# EAGLE schematic bornhack_stoplicht_ws2812_smd_405_cap_r155 (EAGLE 6.1)

## Sheet 1 of 4
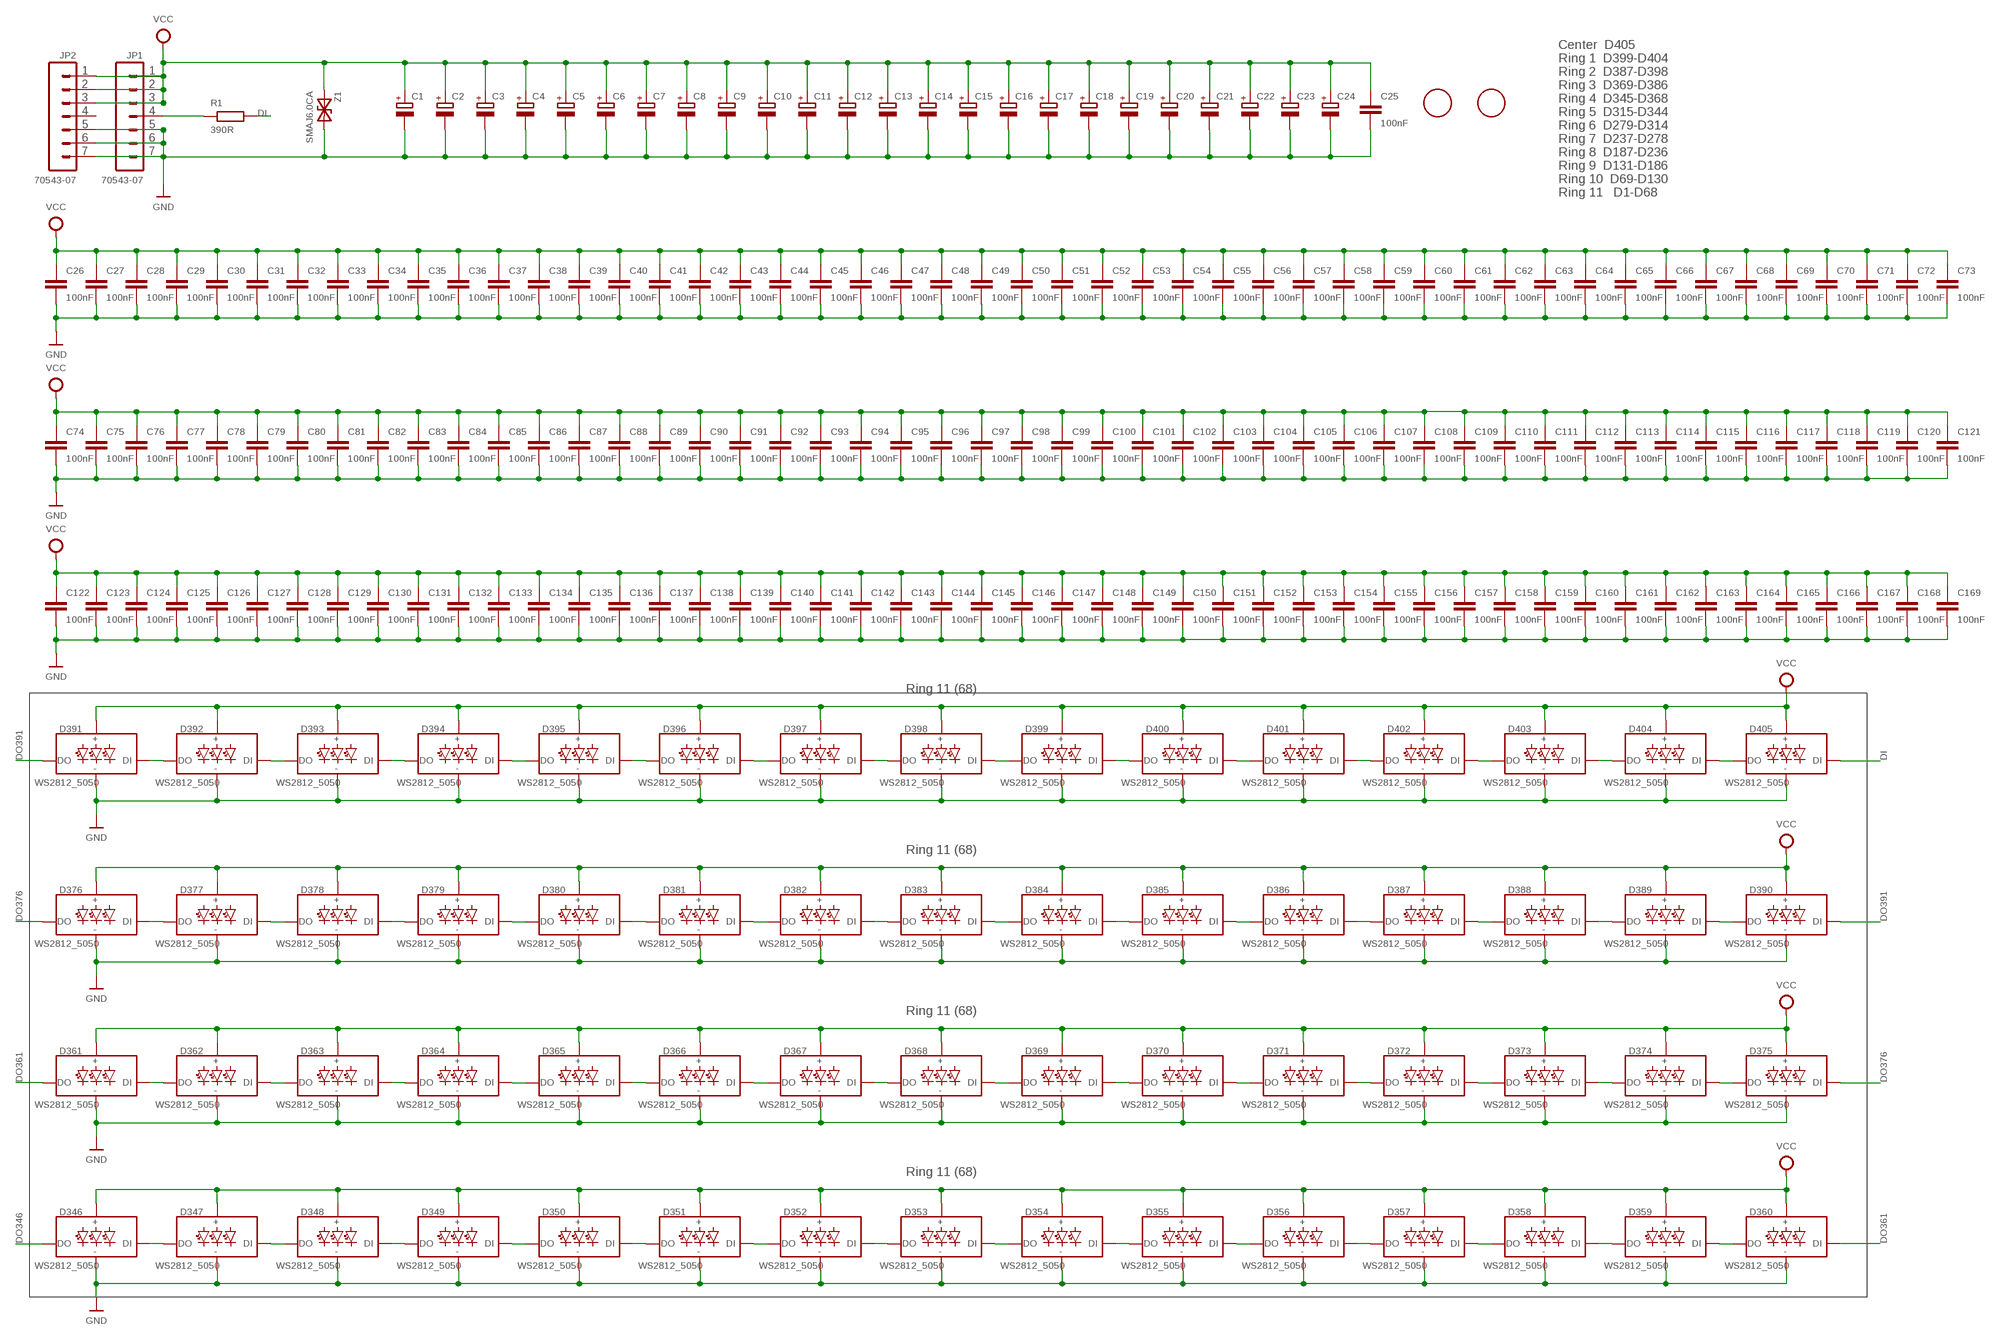
[diagram p0: schematic, sheet 1]

### Parts
C1  CPOL-EUE2.5-6  [E2,5-6]
C2  CPOL-EUE2.5-6  [E2,5-6]
C3  CPOL-EUE2.5-6  [E2,5-6]
C4  CPOL-EUE2.5-6  [E2,5-6]
C5  CPOL-EUE2.5-6  [E2,5-6]
C6  CPOL-EUE2.5-6  [E2,5-6]
C7  CPOL-EUE2.5-6  [E2,5-6]
C8  CPOL-EUE2.5-6  [E2,5-6]
C9  CPOL-EUE2.5-6  [E2,5-6]
C10  CPOL-EUE2.5-6  [E2,5-6]
C11  CPOL-EUE2.5-6  [E2,5-6]
C12  CPOL-EUE2.5-6  [E2,5-6]
C13  CPOL-EUE2.5-6  [E2,5-6]
C14  CPOL-EUE2.5-6  [E2,5-6]
C15  CPOL-EUE2.5-6  [E2,5-6]
C16  CPOL-EUE2.5-6  [E2,5-6]
C17  CPOL-EUE2.5-6  [E2,5-6]
C18  CPOL-EUE2.5-6  [E2,5-6]
C19  CPOL-EUE2.5-6  [E2,5-6]
C20  CPOL-EUE2.5-6  [E2,5-6]
C21  CPOL-EUE2.5-6  [E2,5-6]
C22  CPOL-EUE2.5-6  [E2,5-6]
C23  CPOL-EUE2.5-6  [E2,5-6]
C24  CPOL-EUE2.5-6  [E2,5-6]
C25  100nF  C-EUC0603K  [C0603K]
C26  100nF  C-EUC0603K  [C0603K]
C27  100nF  C-EUC0603K  [C0603K]
C28  100nF  C-EUC0603K  [C0603K]
C29  100nF  C-EUC0603K  [C0603K]
C30  100nF  C-EUC0603K  [C0603K]
C31  100nF  C-EUC0603K  [C0603K]
C32  100nF  C-EUC0603K  [C0603K]
C33  100nF  C-EUC0603K  [C0603K]
C34  100nF  C-EUC0603K  [C0603K]
C35  100nF  C-EUC0603K  [C0603K]
C36  100nF  C-EUC0603K  [C0603K]
C37  100nF  C-EUC0603K  [C0603K]
C38  100nF  C-EUC0603K  [C0603K]
C39  100nF  C-EUC0603K  [C0603K]
C40  100nF  C-EUC0603K  [C0603K]
C41  100nF  C-EUC0603K  [C0603K]
C42  100nF  C-EUC0603K  [C0603K]
C43  100nF  C-EUC0603K  [C0603K]
C44  100nF  C-EUC0603K  [C0603K]
C45  100nF  C-EUC0603K  [C0603K]
C46  100nF  C-EUC0603K  [C0603K]
C47  100nF  C-EUC0603K  [C0603K]
C48  100nF  C-EUC0603K  [C0603K]
C49  100nF  C-EUC0603K  [C0603K]
C50  100nF  C-EUC0603K  [C0603K]
C51  100nF  C-EUC0603K  [C0603K]
C52  100nF  C-EUC0603K  [C0603K]
C53  100nF  C-EUC0603K  [C0603K]
C54  100nF  C-EUC0603K  [C0603K]
C55  100nF  C-EUC0603K  [C0603K]
C56  100nF  C-EUC0603K  [C0603K]
C57  100nF  C-EUC0603K  [C0603K]
C58  100nF  C-EUC0603K  [C0603K]
C59  100nF  C-EUC0603K  [C0603K]
C60  100nF  C-EUC0603K  [C0603K]
C61  100nF  C-EUC0603K  [C0603K]
C62  100nF  C-EUC0603K  [C0603K]
C63  100nF  C-EUC0603K  [C0603K]
C64  100nF  C-EUC0603K  [C0603K]
C65  100nF  C-EUC0603K  [C0603K]
C66  100nF  C-EUC0603K  [C0603K]
C67  100nF  C-EUC0603K  [C0603K]
C68  100nF  C-EUC0603K  [C0603K]
C69  100nF  C-EUC0603K  [C0603K]
C70  100nF  C-EUC0603K  [C0603K]
C71  100nF  C-EUC0603K  [C0603K]
C72  100nF  C-EUC0603K  [C0603K]
C73  100nF  C-EUC0603K  [C0603K]
C74  100nF  C-EUC0603K  [C0603K]
C75  100nF  C-EUC0603K  [C0603K]
C76  100nF  C-EUC0603K  [C0603K]
C77  100nF  C-EUC0603K  [C0603K]
C78  100nF  C-EUC0603K  [C0603K]
C79  100nF  C-EUC0603K  [C0603K]
C80  100nF  C-EUC0603K  [C0603K]
C81  100nF  C-EUC0603K  [C0603K]
C82  100nF  C-EUC0603K  [C0603K]
C83  100nF  C-EUC0603K  [C0603K]
C84  100nF  C-EUC0603K  [C0603K]
C85  100nF  C-EUC0603K  [C0603K]
C86  100nF  C-EUC0603K  [C0603K]
C87  100nF  C-EUC0603K  [C0603K]
C88  100nF  C-EUC0603K  [C0603K]
C89  100nF  C-EUC0603K  [C0603K]
C90  100nF  C-EUC0603K  [C0603K]
C91  100nF  C-EUC0603K  [C0603K]
C92  100nF  C-EUC0603K  [C0603K]
C93  100nF  C-EUC0603K  [C0603K]
C94  100nF  C-EUC0603K  [C0603K]
C95  100nF  C-EUC0603K  [C0603K]
C96  100nF  C-EUC0603K  [C0603K]
C97  100nF  C-EUC0603K  [C0603K]
C98  100nF  C-EUC0603K  [C0603K]
C99  100nF  C-EUC0603K  [C0603K]
C100  100nF  C-EUC0603K  [C0603K]
C101  100nF  C-EUC0603K  [C0603K]
C102  100nF  C-EUC0603K  [C0603K]
C103  100nF  C-EUC0603K  [C0603K]
C104  100nF  C-EUC0603K  [C0603K]
C105  100nF  C-EUC0603K  [C0603K]
C106  100nF  C-EUC0603K  [C0603K]
C107  100nF  C-EUC0603K  [C0603K]
C108  100nF  C-EUC0603K  [C0603K]
C109  100nF  C-EUC0603K  [C0603K]
C110  100nF  C-EUC0603K  [C0603K]
C111  100nF  C-EUC0603K  [C0603K]
C112  100nF  C-EUC0603K  [C0603K]
C113  100nF  C-EUC0603K  [C0603K]
C114  100nF  C-EUC0603K  [C0603K]
C115  100nF  C-EUC0603K  [C0603K]
C116  100nF  C-EUC0603K  [C0603K]
C117  100nF  C-EUC0603K  [C0603K]
C118  100nF  C-EUC0603K  [C0603K]
C119  100nF  C-EUC0603K  [C0603K]
C120  100nF  C-EUC0603K  [C0603K]
C121  100nF  C-EUC0603K  [C0603K]
C122  100nF  C-EUC0603K  [C0603K]
C123  100nF  C-EUC0603K  [C0603K]
C124  100nF  C-EUC0603K  [C0603K]
C125  100nF  C-EUC0603K  [C0603K]
C126  100nF  C-EUC0603K  [C0603K]
C127  100nF  C-EUC0603K  [C0603K]
C128  100nF  C-EUC0603K  [C0603K]
C129  100nF  C-EUC0603K  [C0603K]
C130  100nF  C-EUC0603K  [C0603K]
C131  100nF  C-EUC0603K  [C0603K]
C132  100nF  C-EUC0603K  [C0603K]
C133  100nF  C-EUC0603K  [C0603K]
C134  100nF  C-EUC0603K  [C0603K]
C135  100nF  C-EUC0603K  [C0603K]
C136  100nF  C-EUC0603K  [C0603K]
C137  100nF  C-EUC0603K  [C0603K]
C138  100nF  C-EUC0603K  [C0603K]
C139  100nF  C-EUC0603K  [C0603K]
C140  100nF  C-EUC0603K  [C0603K]
C141  100nF  C-EUC0603K  [C0603K]
C142  100nF  C-EUC0603K  [C0603K]
C143  100nF  C-EUC0603K  [C0603K]
C144  100nF  C-EUC0603K  [C0603K]
C145  100nF  C-EUC0603K  [C0603K]
C146  100nF  C-EUC0603K  [C0603K]
C147  100nF  C-EUC0603K  [C0603K]
C148  100nF  C-EUC0603K  [C0603K]
C149  100nF  C-EUC0603K  [C0603K]
C150  100nF  C-EUC0603K  [C0603K]
C151  100nF  C-EUC0603K  [C0603K]
C152  100nF  C-EUC0603K  [C0603K]
C153  100nF  C-EUC0603K  [C0603K]
C154  100nF  C-EUC0603K  [C0603K]
C155  100nF  C-EUC0603K  [C0603K]
C156  100nF  C-EUC0603K  [C0603K]
C157  100nF  C-EUC0603K  [C0603K]
C158  100nF  C-EUC0603K  [C0603K]
C159  100nF  C-EUC0603K  [C0603K]
C160  100nF  C-EUC0603K  [C0603K]
C161  100nF  C-EUC0603K  [C0603K]
C162  100nF  C-EUC0603K  [C0603K]
C163  100nF  C-EUC0603K  [C0603K]
C164  100nF  C-EUC0603K  [C0603K]
C165  100nF  C-EUC0603K  [C0603K]
C166  100nF  C-EUC0603K  [C0603K]
C167  100nF  C-EUC0603K  [C0603K]
C168  100nF  C-EUC0603K  [C0603K]
C169  100nF  C-EUC0603K  [C0603K]
D346  WS2812_5050  [WS2812-5X5-4PIN]
D347  WS2812_5050  [WS2812-5X5-4PIN]
D348  WS2812_5050  [WS2812-5X5-4PIN]
D349  WS2812_5050  [WS2812-5X5-4PIN]
D350  WS2812_5050  [WS2812-5X5-4PIN]
D351  WS2812_5050  [WS2812-5X5-4PIN]
D352  WS2812_5050  [WS2812-5X5-4PIN]
D353  WS2812_5050  [WS2812-5X5-4PIN]
D354  WS2812_5050  [WS2812-5X5-4PIN]
D355  WS2812_5050  [WS2812-5X5-4PIN]
D356  WS2812_5050  [WS2812-5X5-4PIN]
D357  WS2812_5050  [WS2812-5X5-4PIN]
D358  WS2812_5050  [WS2812-5X5-4PIN]
D359  WS2812_5050  [WS2812-5X5-4PIN]
D360  WS2812_5050  [WS2812-5X5-4PIN]
D361  WS2812_5050  [WS2812-5X5-4PIN]
D362  WS2812_5050  [WS2812-5X5-4PIN]
D363  WS2812_5050  [WS2812-5X5-4PIN]
D364  WS2812_5050  [WS2812-5X5-4PIN]
D365  WS2812_5050  [WS2812-5X5-4PIN]
D366  WS2812_5050  [WS2812-5X5-4PIN]
D367  WS2812_5050  [WS2812-5X5-4PIN]
D368  WS2812_5050  [WS2812-5X5-4PIN]
D369  WS2812_5050  [WS2812-5X5-4PIN]
D370  WS2812_5050  [WS2812-5X5-4PIN]
D371  WS2812_5050  [WS2812-5X5-4PIN]
D372  WS2812_5050  [WS2812-5X5-4PIN]
D373  WS2812_5050  [WS2812-5X5-4PIN]
D374  WS2812_5050  [WS2812-5X5-4PIN]
D375  WS2812_5050  [WS2812-5X5-4PIN]
D376  WS2812_5050  [WS2812-5X5-4PIN]
D377  WS2812_5050  [WS2812-5X5-4PIN]
D378  WS2812_5050  [WS2812-5X5-4PIN]
D379  WS2812_5050  [WS2812-5X5-4PIN]
D380  WS2812_5050  [WS2812-5X5-4PIN]
D381  WS2812_5050  [WS2812-5X5-4PIN]
D382  WS2812_5050  [WS2812-5X5-4PIN]
D383  WS2812_5050  [WS2812-5X5-4PIN]
D384  WS2812_5050  [WS2812-5X5-4PIN]
D385  WS2812_5050  [WS2812-5X5-4PIN]
D386  WS2812_5050  [WS2812-5X5-4PIN]
D387  WS2812_5050  [WS2812-5X5-4PIN]
D388  WS2812_5050  [WS2812-5X5-4PIN]
D389  WS2812_5050  [WS2812-5X5-4PIN]
D390  WS2812_5050  [WS2812-5X5-4PIN]
D391  WS2812_5050  [WS2812-5X5-4PIN]
D392  WS2812_5050  [WS2812-5X5-4PIN]
D393  WS2812_5050  [WS2812-5X5-4PIN]
D394  WS2812_5050  [WS2812-5X5-4PIN]
D395  WS2812_5050  [WS2812-5X5-4PIN]
D396  WS2812_5050  [WS2812-5X5-4PIN]
D397  WS2812_5050  [WS2812-5X5-4PIN]
D398  WS2812_5050  [WS2812-5X5-4PIN]
D399  WS2812_5050  [WS2812-5X5-4PIN]
D400  WS2812_5050  [WS2812-5X5-4PIN]
D401  WS2812_5050  [WS2812-5X5-4PIN]
D402  WS2812_5050  [WS2812-5X5-4PIN]
D403  WS2812_5050  [WS2812-5X5-4PIN]
D404  WS2812_5050  [WS2812-5X5-4PIN]
D405  WS2812_5050  [WS2812-5X5-4PIN]
JP1  70543-07  [70543-07]
JP2  70543-07  [70543-07]
R1  390R  R-EUR0805  [R0805]
U2  FIDUCIAL  [FIDUCIAL_1MM]
U4  FIDUCIAL  [FIDUCIAL_1MM]
Z1  SMAJ6.0CA  [DO214AC]

### Nets
DI: D405.DI R1.2
DO346: D346.DO ; also sheet 2
DO347: D346.DI D347.DO
DO348: D347.DI D348.DO
DO349: D348.DI D349.DO
DO350: D349.DI D350.DO
DO351: D350.DI D351.DO
DO352: D351.DI D352.DO
DO353: D352.DI D353.DO
DO354: D353.DI D354.DO
DO355: D354.DI D355.DO
DO356: D355.DI D356.DO
DO357: D356.DI D357.DO
DO358: D357.DI D358.DO
DO359: D358.DI D359.DO
DO360: D359.DI D360.DO
DO361: D360.DI D361.DO
DO362: D361.DI D362.DO
DO363: D362.DI D363.DO
DO364: D363.DI D364.DO
DO365: D364.DI D365.DO
DO366: D365.DI D366.DO
DO367: D366.DI D367.DO
DO368: D367.DI D368.DO
DO369: D368.DI D369.DO
DO370: D369.DI D370.DO
DO371: D370.DI D371.DO
DO372: D371.DI D372.DO
DO373: D372.DI D373.DO
DO374: D373.DI D374.DO
DO375: D374.DI D375.DO
DO376: D375.DI D376.DO
DO377: D376.DI D377.DO
DO378: D377.DI D378.DO
DO379: D378.DI D379.DO
DO380: D379.DI D380.DO
DO381: D380.DI D381.DO
DO382: D381.DI D382.DO
DO383: D382.DI D383.DO
DO384: D383.DI D384.DO
DO385: D384.DI D385.DO
DO386: D385.DI D386.DO
DO387: D386.DI D387.DO
DO388: D387.DI D388.DO
DO389: D388.DI D389.DO
DO390: D389.DI D390.DO
DO391: D390.DI D391.DO
DO392: D391.DI D392.DO
DO393: D392.DI D393.DO
DO394: D393.DI D394.DO
DO395: D394.DI D395.DO
DO396: D395.DI D396.DO
DO397: D396.DI D397.DO
DO398: D397.DI D398.DO
DO399: D398.DI D399.DO
DO400: D399.DI D400.DO
DO401: D400.DI D401.DO
DO402: D401.DI D402.DO
DO403: D402.DI D403.DO
DO404: D403.DI D404.DO
DO405: D404.DI D405.DO
GND: C1.- C2.- C3.- C4.- C5.- C6.- C7.- C8.- C9.- C10.- C11.- C12.- C13.- C14.- C15.- C16.- C17.- C18.- C19.- C20.- C21.- C22.- C23.- C24.- C25.2 C26.2 C27.2 C28.2 C29.2 C30.2 C31.2 C32.2 C33.2 C34.2 C35.2 C36.2 C37.2 C38.2 C39.2 C40.2 C41.2 C42.2 C43.2 C44.2 C45.2 C46.2 C47.2 C48.2 C49.2 C50.2 C51.2 C52.2 C53.2 C54.2 C55.2 C56.2 C57.2 C58.2 C59.2 C60.2 C61.2 C62.2 C63.2 C64.2 C65.2 C66.2 C67.2 C68.2 C69.2 C70.2 C71.2 C72.2 C73.2 C74.2 C75.2 C76.2 C77.2 C78.2 C79.2 C80.2 C81.2 C82.2 C83.2 C84.2 C85.2 C86.2 C87.2 C88.2 C89.2 C90.2 C91.2 C92.2 C93.2 C94.2 C95.2 C96.2 C97.2 C98.2 C99.2 C100.2 C101.2 C102.2 C103.2 C104.2 C105.2 C106.2 C107.2 C108.2 C109.2 C110.2 C111.2 C112.2 C113.2 C114.2 C115.2 C116.2 C117.2 C118.2 C119.2 C120.2 C121.2 C122.2 C123.2 C124.2 C125.2 C126.2 C127.2 C128.2 C129.2 C130.2 C131.2 C132.2 C133.2 C134.2 C135.2 C136.2 C137.2 C138.2 C139.2 C140.2 C141.2 C142.2 C143.2 C144.2 C145.2 C146.2 C147.2 C148.2 C149.2 C150.2 C151.2 C152.2 C153.2 C154.2 C155.2 C156.2 C157.2 C158.2 C159.2 C160.2 C161.2 C162.2 C163.2 C164.2 C165.2 C166.2 C167.2 C168.2 C169.2 D346.GND D347.GND D348.GND D349.GND D350.GND D351.GND D352.GND D353.GND D354.GND D355.GND D356.GND D357.GND D358.GND D359.GND D360.GND D361.GND D362.GND D363.GND D364.GND D365.GND D366.GND D367.GND D368.GND D369.GND D370.GND D371.GND D372.GND D373.GND D374.GND D375.GND D376.GND D377.GND D378.GND D379.GND D380.GND D381.GND D382.GND D383.GND D384.GND D385.GND D386.GND D387.GND D388.GND D389.GND D390.GND D391.GND D392.GND D393.GND D394.GND D395.GND D396.GND D397.GND D398.GND D399.GND D400.GND D401.GND D402.GND D403.GND D404.GND D405.GND JP1.5 JP1.6 JP1.7 JP2.5 JP2.6 JP2.7 Z1.2 ; also sheet 2,3,4
IN: JP1.4 R1.1
VCC: C1.+ C2.+ C3.+ C4.+ C5.+ C6.+ C7.+ C8.+ C9.+ C10.+ C11.+ C12.+ C13.+ C14.+ C15.+ C16.+ C17.+ C18.+ C19.+ C20.+ C21.+ C22.+ C23.+ C24.+ C25.1 C26.1 C27.1 C28.1 C29.1 C30.1 C31.1 C32.1 C33.1 C34.1 C35.1 C36.1 C37.1 C38.1 C39.1 C40.1 C41.1 C42.1 C43.1 C44.1 C45.1 C46.1 C47.1 C48.1 C49.1 C50.1 C51.1 C52.1 C53.1 C54.1 C55.1 C56.1 C57.1 C58.1 C59.1 C60.1 C61.1 C62.1 C63.1 C64.1 C65.1 C66.1 C67.1 C68.1 C69.1 C70.1 C71.1 C72.1 C73.1 C74.1 C75.1 C76.1 C77.1 C78.1 C79.1 C80.1 C81.1 C82.1 C83.1 C84.1 C85.1 C86.1 C87.1 C88.1 C89.1 C90.1 C91.1 C92.1 C93.1 C94.1 C95.1 C96.1 C97.1 C98.1 C99.1 C100.1 C101.1 C102.1 C103.1 C104.1 C105.1 C106.1 C107.1 C108.1 C109.1 C110.1 C111.1 C112.1 C113.1 C114.1 C115.1 C116.1 C117.1 C118.1 C119.1 C120.1 C121.1 C122.1 C123.1 C124.1 C125.1 C126.1 C127.1 C128.1 C129.1 C130.1 C131.1 C132.1 C133.1 C134.1 C135.1 C136.1 C137.1 C138.1 C139.1 C140.1 C141.1 C142.1 C143.1 C144.1 C145.1 C146.1 C147.1 C148.1 C149.1 C150.1 C151.1 C152.1 C153.1 C154.1 C155.1 C156.1 C157.1 C158.1 C159.1 C160.1 C161.1 C162.1 C163.1 C164.1 C165.1 C166.1 C167.1 C168.1 C169.1 D346.VCC D347.VCC D348.VCC D349.VCC D350.VCC D351.VCC D352.VCC D353.VCC D354.VCC D355.VCC D356.VCC D357.VCC D358.VCC D359.VCC D360.VCC D361.VCC D362.VCC D363.VCC D364.VCC D365.VCC D366.VCC D367.VCC D368.VCC D369.VCC D370.VCC D371.VCC D372.VCC D373.VCC D374.VCC D375.VCC D376.VCC D377.VCC D378.VCC D379.VCC D380.VCC D381.VCC D382.VCC D383.VCC D384.VCC D385.VCC D386.VCC D387.VCC D388.VCC D389.VCC D390.VCC D391.VCC D392.VCC D393.VCC D394.VCC D395.VCC D396.VCC D397.VCC D398.VCC D399.VCC D400.VCC D401.VCC D402.VCC D403.VCC D404.VCC D405.VCC JP1.1 JP1.2 JP1.3 JP2.1 JP2.2 JP2.3 Z1.1 ; also sheet 2,3,4
Unconnected: JP2.4

### Notes on the sheet
- Center  D405
- Ring 1  D399-D404
- Ring 2  D387-D398
- Ring 3  D369-D386
- Ring 4  D345-D368
- Ring 5  D315-D344
- Ring 6  D279-D314
- Ring 7  D237-D278
- Ring 8  D187-D236
- Ring 9  D131-D186
- Ring 10  D69-D130
- Ring 11   D1-D68
- Ring 11 (68)
- Ring 11 (68)
- Ring 11 (68)
- Ring 11 (68)

## Sheet 2 of 4
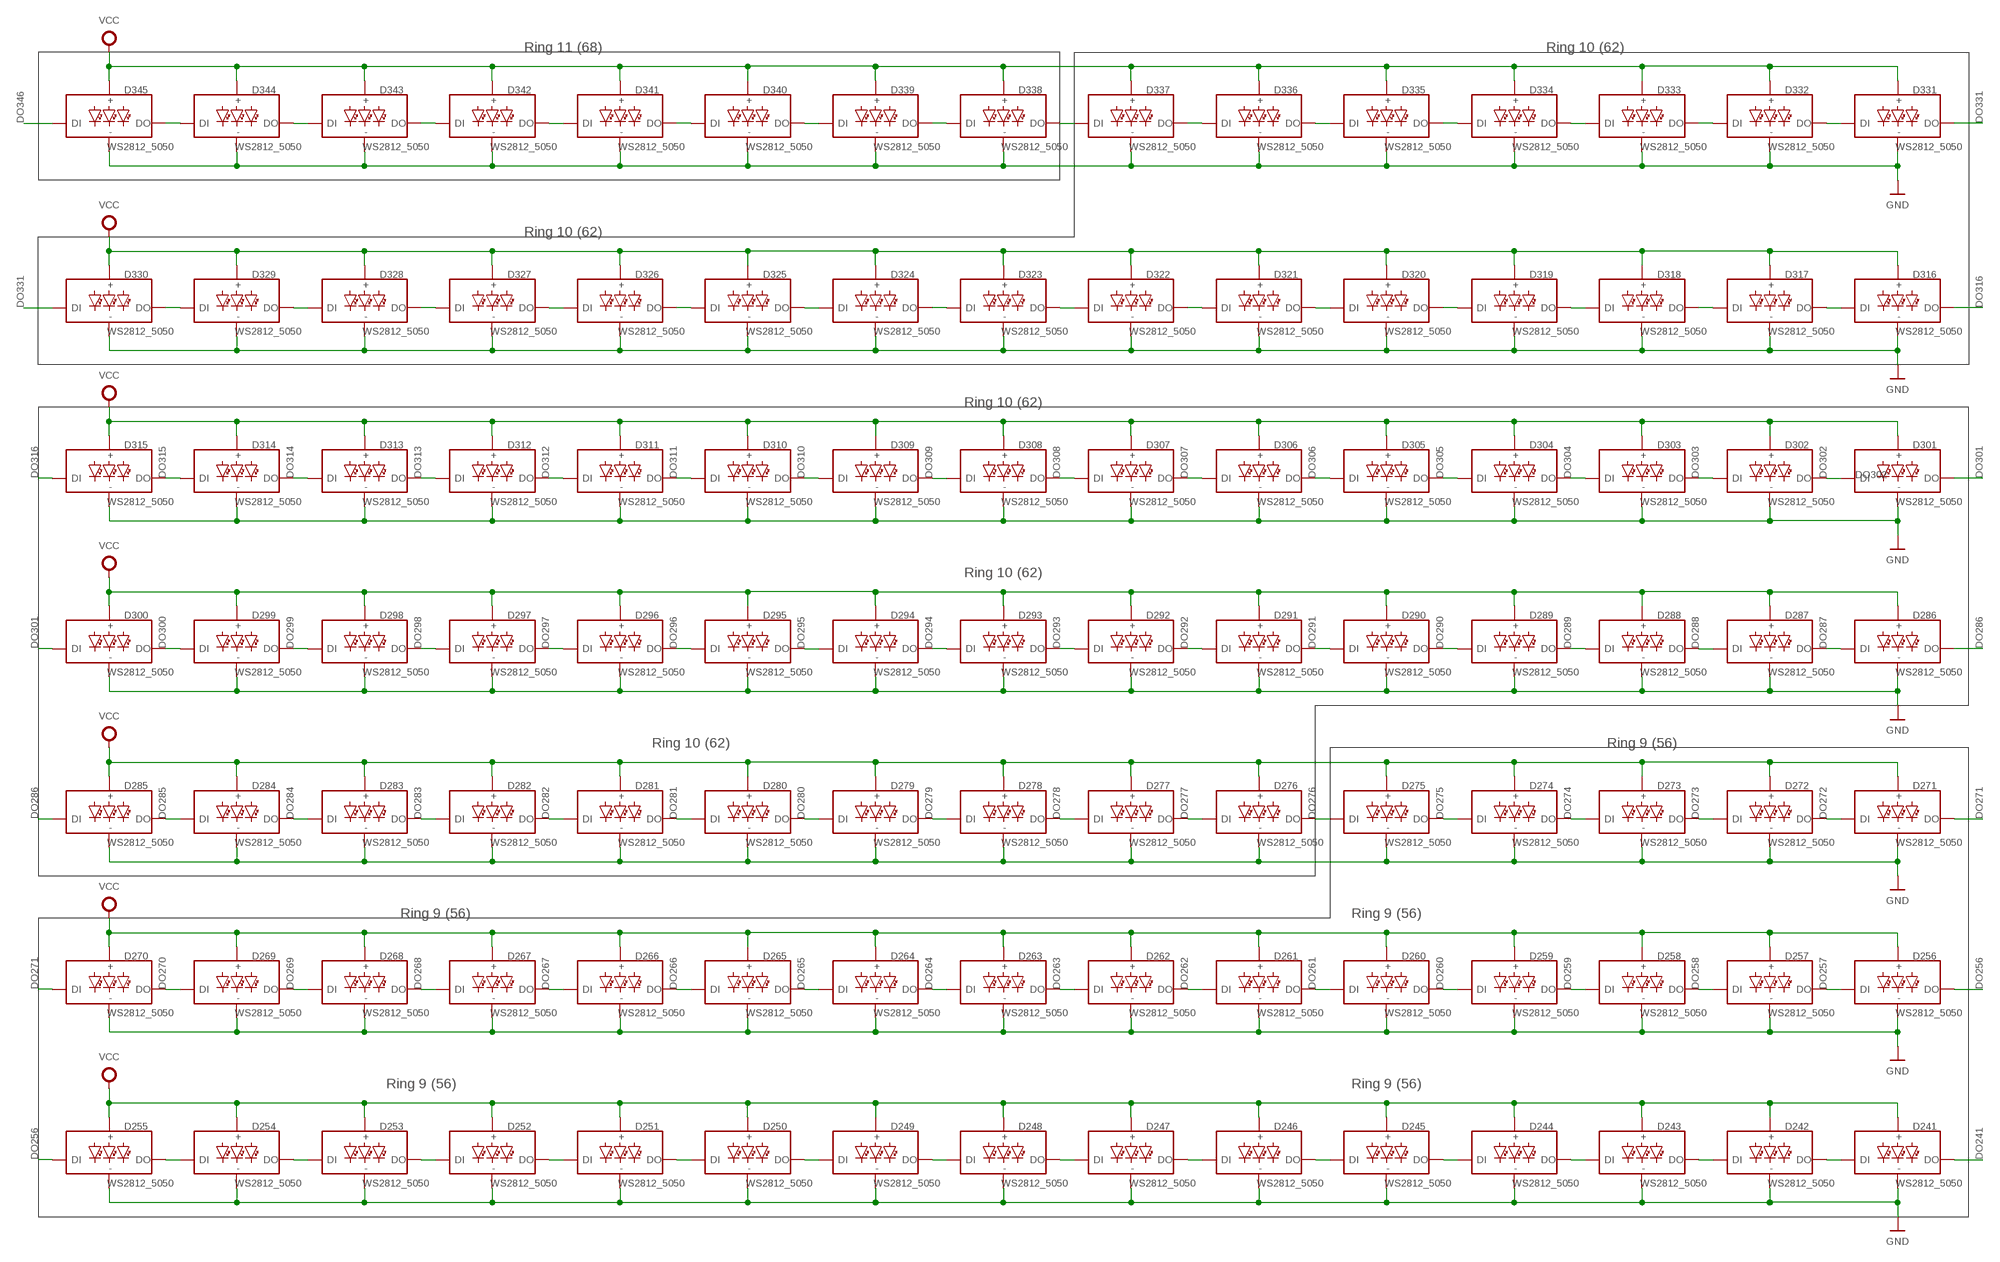
[diagram p1: schematic, sheet 2]

### Parts
D241  WS2812_5050  [WS2812-5X5-4PIN]
D242  WS2812_5050  [WS2812-5X5-4PIN]
D243  WS2812_5050  [WS2812-5X5-4PIN]
D244  WS2812_5050  [WS2812-5X5-4PIN]
D245  WS2812_5050  [WS2812-5X5-4PIN]
D246  WS2812_5050  [WS2812-5X5-4PIN]
D247  WS2812_5050  [WS2812-5X5-4PIN]
D248  WS2812_5050  [WS2812-5X5-4PIN]
D249  WS2812_5050  [WS2812-5X5-4PIN]
D250  WS2812_5050  [WS2812-5X5-4PIN]
D251  WS2812_5050  [WS2812-5X5-4PIN]
D252  WS2812_5050  [WS2812-5X5-4PIN]
D253  WS2812_5050  [WS2812-5X5-4PIN]
D254  WS2812_5050  [WS2812-5X5-4PIN]
D255  WS2812_5050  [WS2812-5X5-4PIN]
D256  WS2812_5050  [WS2812-5X5-4PIN]
D257  WS2812_5050  [WS2812-5X5-4PIN]
D258  WS2812_5050  [WS2812-5X5-4PIN]
D259  WS2812_5050  [WS2812-5X5-4PIN]
D260  WS2812_5050  [WS2812-5X5-4PIN]
D261  WS2812_5050  [WS2812-5X5-4PIN]
D262  WS2812_5050  [WS2812-5X5-4PIN]
D263  WS2812_5050  [WS2812-5X5-4PIN]
D264  WS2812_5050  [WS2812-5X5-4PIN]
D265  WS2812_5050  [WS2812-5X5-4PIN]
D266  WS2812_5050  [WS2812-5X5-4PIN]
D267  WS2812_5050  [WS2812-5X5-4PIN]
D268  WS2812_5050  [WS2812-5X5-4PIN]
D269  WS2812_5050  [WS2812-5X5-4PIN]
D270  WS2812_5050  [WS2812-5X5-4PIN]
D271  WS2812_5050  [WS2812-5X5-4PIN]
D272  WS2812_5050  [WS2812-5X5-4PIN]
D273  WS2812_5050  [WS2812-5X5-4PIN]
D274  WS2812_5050  [WS2812-5X5-4PIN]
D275  WS2812_5050  [WS2812-5X5-4PIN]
D276  WS2812_5050  [WS2812-5X5-4PIN]
D277  WS2812_5050  [WS2812-5X5-4PIN]
D278  WS2812_5050  [WS2812-5X5-4PIN]
D279  WS2812_5050  [WS2812-5X5-4PIN]
D280  WS2812_5050  [WS2812-5X5-4PIN]
D281  WS2812_5050  [WS2812-5X5-4PIN]
D282  WS2812_5050  [WS2812-5X5-4PIN]
D283  WS2812_5050  [WS2812-5X5-4PIN]
D284  WS2812_5050  [WS2812-5X5-4PIN]
D285  WS2812_5050  [WS2812-5X5-4PIN]
D286  WS2812_5050  [WS2812-5X5-4PIN]
D287  WS2812_5050  [WS2812-5X5-4PIN]
D288  WS2812_5050  [WS2812-5X5-4PIN]
D289  WS2812_5050  [WS2812-5X5-4PIN]
D290  WS2812_5050  [WS2812-5X5-4PIN]
D291  WS2812_5050  [WS2812-5X5-4PIN]
D292  WS2812_5050  [WS2812-5X5-4PIN]
D293  WS2812_5050  [WS2812-5X5-4PIN]
D294  WS2812_5050  [WS2812-5X5-4PIN]
D295  WS2812_5050  [WS2812-5X5-4PIN]
D296  WS2812_5050  [WS2812-5X5-4PIN]
D297  WS2812_5050  [WS2812-5X5-4PIN]
D298  WS2812_5050  [WS2812-5X5-4PIN]
D299  WS2812_5050  [WS2812-5X5-4PIN]
D300  WS2812_5050  [WS2812-5X5-4PIN]
D301  WS2812_5050  [WS2812-5X5-4PIN]
D302  WS2812_5050  [WS2812-5X5-4PIN]
D303  WS2812_5050  [WS2812-5X5-4PIN]
D304  WS2812_5050  [WS2812-5X5-4PIN]
D305  WS2812_5050  [WS2812-5X5-4PIN]
D306  WS2812_5050  [WS2812-5X5-4PIN]
D307  WS2812_5050  [WS2812-5X5-4PIN]
D308  WS2812_5050  [WS2812-5X5-4PIN]
D309  WS2812_5050  [WS2812-5X5-4PIN]
D310  WS2812_5050  [WS2812-5X5-4PIN]
D311  WS2812_5050  [WS2812-5X5-4PIN]
D312  WS2812_5050  [WS2812-5X5-4PIN]
D313  WS2812_5050  [WS2812-5X5-4PIN]
D314  WS2812_5050  [WS2812-5X5-4PIN]
D315  WS2812_5050  [WS2812-5X5-4PIN]
D316  WS2812_5050  [WS2812-5X5-4PIN]
D317  WS2812_5050  [WS2812-5X5-4PIN]
D318  WS2812_5050  [WS2812-5X5-4PIN]
D319  WS2812_5050  [WS2812-5X5-4PIN]
D320  WS2812_5050  [WS2812-5X5-4PIN]
D321  WS2812_5050  [WS2812-5X5-4PIN]
D322  WS2812_5050  [WS2812-5X5-4PIN]
D323  WS2812_5050  [WS2812-5X5-4PIN]
D324  WS2812_5050  [WS2812-5X5-4PIN]
D325  WS2812_5050  [WS2812-5X5-4PIN]
D326  WS2812_5050  [WS2812-5X5-4PIN]
D327  WS2812_5050  [WS2812-5X5-4PIN]
D328  WS2812_5050  [WS2812-5X5-4PIN]
D329  WS2812_5050  [WS2812-5X5-4PIN]
D330  WS2812_5050  [WS2812-5X5-4PIN]
D331  WS2812_5050  [WS2812-5X5-4PIN]
D332  WS2812_5050  [WS2812-5X5-4PIN]
D333  WS2812_5050  [WS2812-5X5-4PIN]
D334  WS2812_5050  [WS2812-5X5-4PIN]
D335  WS2812_5050  [WS2812-5X5-4PIN]
D336  WS2812_5050  [WS2812-5X5-4PIN]
D337  WS2812_5050  [WS2812-5X5-4PIN]
D338  WS2812_5050  [WS2812-5X5-4PIN]
D339  WS2812_5050  [WS2812-5X5-4PIN]
D340  WS2812_5050  [WS2812-5X5-4PIN]
D341  WS2812_5050  [WS2812-5X5-4PIN]
D342  WS2812_5050  [WS2812-5X5-4PIN]
D343  WS2812_5050  [WS2812-5X5-4PIN]
D344  WS2812_5050  [WS2812-5X5-4PIN]
D345  WS2812_5050  [WS2812-5X5-4PIN]

### Nets
DO241: D241.DO ; also sheet 3
DO242: D241.DI D242.DO
DO243: D242.DI D243.DO
DO244: D243.DI D244.DO
DO245: D244.DI D245.DO
DO246: D245.DI D246.DO
DO247: D246.DI D247.DO
DO248: D247.DI D248.DO
DO249: D248.DI D249.DO
DO250: D249.DI D250.DO
DO251: D250.DI D251.DO
DO252: D251.DI D252.DO
DO253: D252.DI D253.DO
DO254: D253.DI D254.DO
DO255: D254.DI D255.DO
DO256: D255.DI D256.DO
DO257: D256.DI D257.DO
DO258: D257.DI D258.DO
DO259: D258.DI D259.DO
DO260: D259.DI D260.DO
DO261: D260.DI D261.DO
DO262: D261.DI D262.DO
DO263: D262.DI D263.DO
DO264: D263.DI D264.DO
DO265: D264.DI D265.DO
DO266: D265.DI D266.DO
DO267: D266.DI D267.DO
DO268: D267.DI D268.DO
DO269: D268.DI D269.DO
DO270: D269.DI D270.DO
DO271: D270.DI D271.DO
DO272: D271.DI D272.DO
DO273: D272.DI D273.DO
DO274: D273.DI D274.DO
DO275: D274.DI D275.DO
DO276: D275.DI D276.DO
DO277: D276.DI D277.DO
DO278: D277.DI D278.DO
DO279: D278.DI D279.DO
DO280: D279.DI D280.DO
DO281: D280.DI D281.DO
DO282: D281.DI D282.DO
DO283: D282.DI D283.DO
DO284: D283.DI D284.DO
DO285: D284.DI D285.DO
DO286: D285.DI D286.DO
DO287: D286.DI D287.DO
DO288: D287.DI D288.DO
DO289: D288.DI D289.DO
DO290: D289.DI D290.DO
DO291: D290.DI D291.DO
DO292: D291.DI D292.DO
DO293: D292.DI D293.DO
DO294: D293.DI D294.DO
DO295: D294.DI D295.DO
DO296: D295.DI D296.DO
DO297: D296.DI D297.DO
DO298: D297.DI D298.DO
DO299: D298.DI D299.DO
DO300: D299.DI D300.DO
DO301: D300.DI D301.DO
DO302: D301.DI D302.DO
DO303: D302.DI D303.DO
DO304: D303.DI D304.DO
DO305: D304.DI D305.DO
DO306: D305.DI D306.DO
DO307: D306.DI D307.DO
DO308: D307.DI D308.DO
DO309: D308.DI D309.DO
DO310: D309.DI D310.DO
DO311: D310.DI D311.DO
DO312: D311.DI D312.DO
DO313: D312.DI D313.DO
DO314: D313.DI D314.DO
DO315: D314.DI D315.DO
DO316: D315.DI D316.DO
DO317: D316.DI D317.DO
DO318: D317.DI D318.DO
DO319: D318.DI D319.DO
DO320: D319.DI D320.DO
DO321: D320.DI D321.DO
DO322: D321.DI D322.DO
DO323: D322.DI D323.DO
DO324: D323.DI D324.DO
DO325: D324.DI D325.DO
DO326: D325.DI D326.DO
DO327: D326.DI D327.DO
DO328: D327.DI D328.DO
DO329: D328.DI D329.DO
DO330: D329.DI D330.DO
DO331: D330.DI D331.DO
DO332: D331.DI D332.DO
DO333: D332.DI D333.DO
DO334: D333.DI D334.DO
DO335: D334.DI D335.DO
DO336: D335.DI D336.DO
DO337: D336.DI D337.DO
DO338: D337.DI D338.DO
DO339: D338.DI D339.DO
DO340: D339.DI D340.DO
DO341: D340.DI D341.DO
DO342: D341.DI D342.DO
DO343: D342.DI D343.DO
DO344: D343.DI D344.DO
DO345: D344.DI D345.DO
DO346: D345.DI ; also sheet 1
GND: D241.GND D242.GND D243.GND D244.GND D245.GND D246.GND D247.GND D248.GND D249.GND D250.GND D251.GND D252.GND D253.GND D254.GND D255.GND D256.GND D257.GND D258.GND D259.GND D260.GND D261.GND D262.GND D263.GND D264.GND D265.GND D266.GND D267.GND D268.GND D269.GND D270.GND D271.GND D272.GND D273.GND D274.GND D275.GND D276.GND D277.GND D278.GND D279.GND D280.GND D281.GND D282.GND D283.GND D284.GND D285.GND D286.GND D287.GND D288.GND D289.GND D290.GND D291.GND D292.GND D293.GND D294.GND D295.GND D296.GND D297.GND D298.GND D299.GND D300.GND D301.GND D302.GND D303.GND D304.GND D305.GND D306.GND D307.GND D308.GND D309.GND D310.GND D311.GND D312.GND D313.GND D314.GND D315.GND D316.GND D317.GND D318.GND D319.GND D320.GND D321.GND D322.GND D323.GND D324.GND D325.GND D326.GND D327.GND D328.GND D329.GND D330.GND D331.GND D332.GND D333.GND D334.GND D335.GND D336.GND D337.GND D338.GND D339.GND D340.GND D341.GND D342.GND D343.GND D344.GND D345.GND ; also sheet 1,3,4
VCC: D241.VCC D242.VCC D243.VCC D244.VCC D245.VCC D246.VCC D247.VCC D248.VCC D249.VCC D250.VCC D251.VCC D252.VCC D253.VCC D254.VCC D255.VCC D256.VCC D257.VCC D258.VCC D259.VCC D260.VCC D261.VCC D262.VCC D263.VCC D264.VCC D265.VCC D266.VCC D267.VCC D268.VCC D269.VCC D270.VCC D271.VCC D272.VCC D273.VCC D274.VCC D275.VCC D276.VCC D277.VCC D278.VCC D279.VCC D280.VCC D281.VCC D282.VCC D283.VCC D284.VCC D285.VCC D286.VCC D287.VCC D288.VCC D289.VCC D290.VCC D291.VCC D292.VCC D293.VCC D294.VCC D295.VCC D296.VCC D297.VCC D298.VCC D299.VCC D300.VCC D301.VCC D302.VCC D303.VCC D304.VCC D305.VCC D306.VCC D307.VCC D308.VCC D309.VCC D310.VCC D311.VCC D312.VCC D313.VCC D314.VCC D315.VCC D316.VCC D317.VCC D318.VCC D319.VCC D320.VCC D321.VCC D322.VCC D323.VCC D324.VCC D325.VCC D326.VCC D327.VCC D328.VCC D329.VCC D330.VCC D331.VCC D332.VCC D333.VCC D334.VCC D335.VCC D336.VCC D337.VCC D338.VCC D339.VCC D340.VCC D341.VCC D342.VCC D343.VCC D344.VCC D345.VCC ; also sheet 1,3,4

### Notes on the sheet
- Ring 11 (68) | Ring 10 (62)
- Ring 10 (62)
- Ring 10 (62)
- Ring 10 (62)
- Ring 10 (62) | Ring 9 (56)
- Ring 9 (56) | Ring 9 (56)
- Ring 9 (56) | Ring 9 (56)

## Sheet 3 of 4
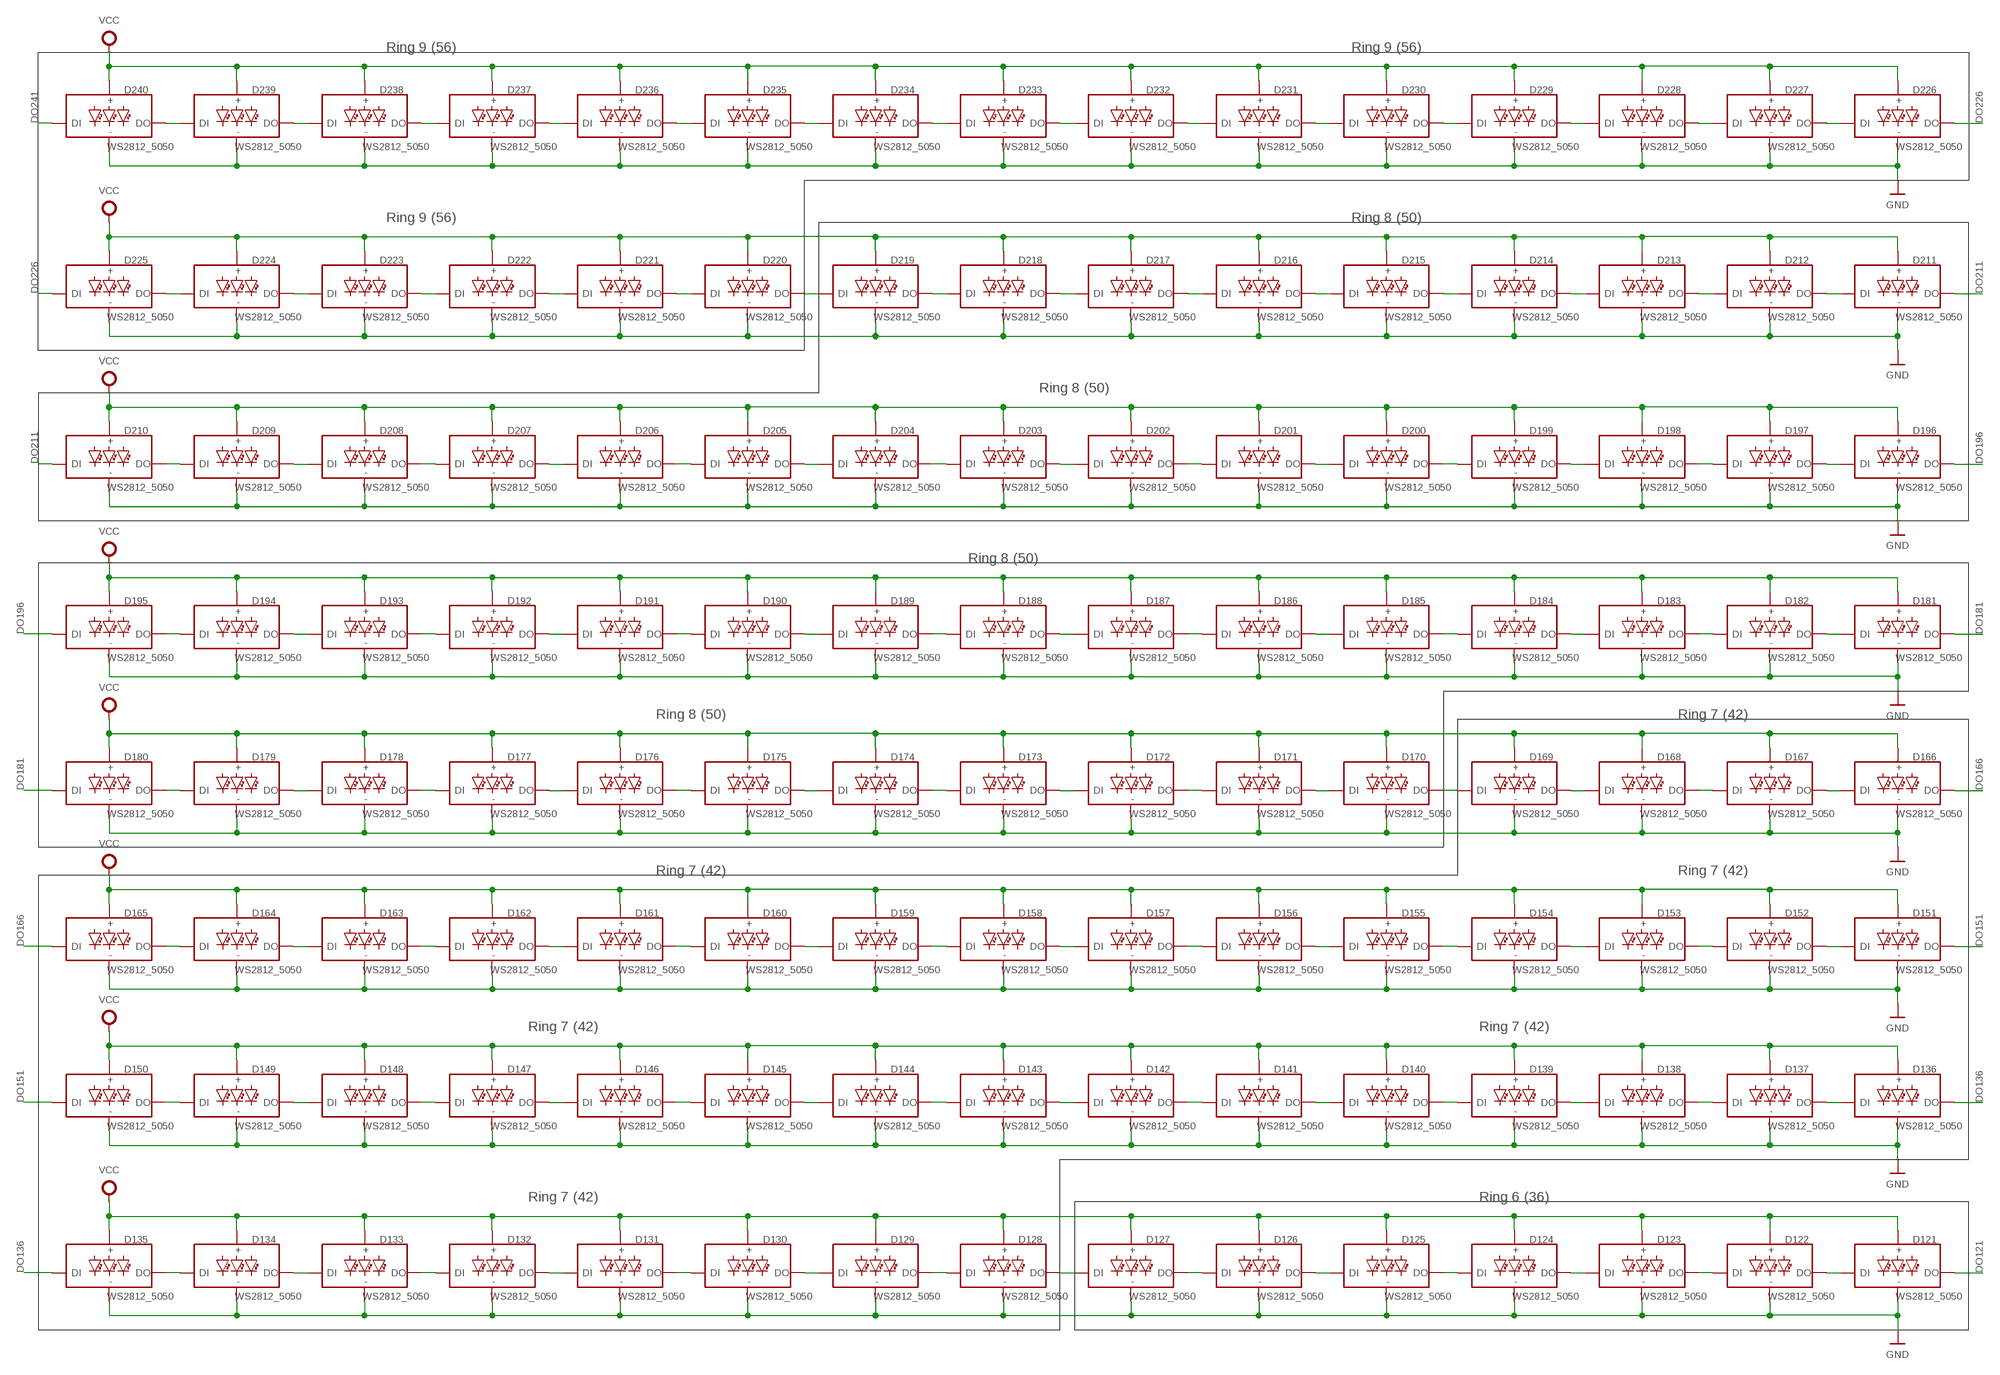
[diagram p2: schematic, sheet 3]

### Parts
D121  WS2812_5050  [WS2812-5X5-4PIN]
D122  WS2812_5050  [WS2812-5X5-4PIN]
D123  WS2812_5050  [WS2812-5X5-4PIN]
D124  WS2812_5050  [WS2812-5X5-4PIN]
D125  WS2812_5050  [WS2812-5X5-4PIN]
D126  WS2812_5050  [WS2812-5X5-4PIN]
D127  WS2812_5050  [WS2812-5X5-4PIN]
D128  WS2812_5050  [WS2812-5X5-4PIN]
D129  WS2812_5050  [WS2812-5X5-4PIN]
D130  WS2812_5050  [WS2812-5X5-4PIN]
D131  WS2812_5050  [WS2812-5X5-4PIN]
D132  WS2812_5050  [WS2812-5X5-4PIN]
D133  WS2812_5050  [WS2812-5X5-4PIN]
D134  WS2812_5050  [WS2812-5X5-4PIN]
D135  WS2812_5050  [WS2812-5X5-4PIN]
D136  WS2812_5050  [WS2812-5X5-4PIN]
D137  WS2812_5050  [WS2812-5X5-4PIN]
D138  WS2812_5050  [WS2812-5X5-4PIN]
D139  WS2812_5050  [WS2812-5X5-4PIN]
D140  WS2812_5050  [WS2812-5X5-4PIN]
D141  WS2812_5050  [WS2812-5X5-4PIN]
D142  WS2812_5050  [WS2812-5X5-4PIN]
D143  WS2812_5050  [WS2812-5X5-4PIN]
D144  WS2812_5050  [WS2812-5X5-4PIN]
D145  WS2812_5050  [WS2812-5X5-4PIN]
D146  WS2812_5050  [WS2812-5X5-4PIN]
D147  WS2812_5050  [WS2812-5X5-4PIN]
D148  WS2812_5050  [WS2812-5X5-4PIN]
D149  WS2812_5050  [WS2812-5X5-4PIN]
D150  WS2812_5050  [WS2812-5X5-4PIN]
D151  WS2812_5050  [WS2812-5X5-4PIN]
D152  WS2812_5050  [WS2812-5X5-4PIN]
D153  WS2812_5050  [WS2812-5X5-4PIN]
D154  WS2812_5050  [WS2812-5X5-4PIN]
D155  WS2812_5050  [WS2812-5X5-4PIN]
D156  WS2812_5050  [WS2812-5X5-4PIN]
D157  WS2812_5050  [WS2812-5X5-4PIN]
D158  WS2812_5050  [WS2812-5X5-4PIN]
D159  WS2812_5050  [WS2812-5X5-4PIN]
D160  WS2812_5050  [WS2812-5X5-4PIN]
D161  WS2812_5050  [WS2812-5X5-4PIN]
D162  WS2812_5050  [WS2812-5X5-4PIN]
D163  WS2812_5050  [WS2812-5X5-4PIN]
D164  WS2812_5050  [WS2812-5X5-4PIN]
D165  WS2812_5050  [WS2812-5X5-4PIN]
D166  WS2812_5050  [WS2812-5X5-4PIN]
D167  WS2812_5050  [WS2812-5X5-4PIN]
D168  WS2812_5050  [WS2812-5X5-4PIN]
D169  WS2812_5050  [WS2812-5X5-4PIN]
D170  WS2812_5050  [WS2812-5X5-4PIN]
D171  WS2812_5050  [WS2812-5X5-4PIN]
D172  WS2812_5050  [WS2812-5X5-4PIN]
D173  WS2812_5050  [WS2812-5X5-4PIN]
D174  WS2812_5050  [WS2812-5X5-4PIN]
D175  WS2812_5050  [WS2812-5X5-4PIN]
D176  WS2812_5050  [WS2812-5X5-4PIN]
D177  WS2812_5050  [WS2812-5X5-4PIN]
D178  WS2812_5050  [WS2812-5X5-4PIN]
D179  WS2812_5050  [WS2812-5X5-4PIN]
D180  WS2812_5050  [WS2812-5X5-4PIN]
D181  WS2812_5050  [WS2812-5X5-4PIN]
D182  WS2812_5050  [WS2812-5X5-4PIN]
D183  WS2812_5050  [WS2812-5X5-4PIN]
D184  WS2812_5050  [WS2812-5X5-4PIN]
D185  WS2812_5050  [WS2812-5X5-4PIN]
D186  WS2812_5050  [WS2812-5X5-4PIN]
D187  WS2812_5050  [WS2812-5X5-4PIN]
D188  WS2812_5050  [WS2812-5X5-4PIN]
D189  WS2812_5050  [WS2812-5X5-4PIN]
D190  WS2812_5050  [WS2812-5X5-4PIN]
D191  WS2812_5050  [WS2812-5X5-4PIN]
D192  WS2812_5050  [WS2812-5X5-4PIN]
D193  WS2812_5050  [WS2812-5X5-4PIN]
D194  WS2812_5050  [WS2812-5X5-4PIN]
D195  WS2812_5050  [WS2812-5X5-4PIN]
D196  WS2812_5050  [WS2812-5X5-4PIN]
D197  WS2812_5050  [WS2812-5X5-4PIN]
D198  WS2812_5050  [WS2812-5X5-4PIN]
D199  WS2812_5050  [WS2812-5X5-4PIN]
D200  WS2812_5050  [WS2812-5X5-4PIN]
D201  WS2812_5050  [WS2812-5X5-4PIN]
D202  WS2812_5050  [WS2812-5X5-4PIN]
D203  WS2812_5050  [WS2812-5X5-4PIN]
D204  WS2812_5050  [WS2812-5X5-4PIN]
D205  WS2812_5050  [WS2812-5X5-4PIN]
D206  WS2812_5050  [WS2812-5X5-4PIN]
D207  WS2812_5050  [WS2812-5X5-4PIN]
D208  WS2812_5050  [WS2812-5X5-4PIN]
D209  WS2812_5050  [WS2812-5X5-4PIN]
D210  WS2812_5050  [WS2812-5X5-4PIN]
D211  WS2812_5050  [WS2812-5X5-4PIN]
D212  WS2812_5050  [WS2812-5X5-4PIN]
D213  WS2812_5050  [WS2812-5X5-4PIN]
D214  WS2812_5050  [WS2812-5X5-4PIN]
D215  WS2812_5050  [WS2812-5X5-4PIN]
D216  WS2812_5050  [WS2812-5X5-4PIN]
D217  WS2812_5050  [WS2812-5X5-4PIN]
D218  WS2812_5050  [WS2812-5X5-4PIN]
D219  WS2812_5050  [WS2812-5X5-4PIN]
D220  WS2812_5050  [WS2812-5X5-4PIN]
D221  WS2812_5050  [WS2812-5X5-4PIN]
D222  WS2812_5050  [WS2812-5X5-4PIN]
D223  WS2812_5050  [WS2812-5X5-4PIN]
D224  WS2812_5050  [WS2812-5X5-4PIN]
D225  WS2812_5050  [WS2812-5X5-4PIN]
D226  WS2812_5050  [WS2812-5X5-4PIN]
D227  WS2812_5050  [WS2812-5X5-4PIN]
D228  WS2812_5050  [WS2812-5X5-4PIN]
D229  WS2812_5050  [WS2812-5X5-4PIN]
D230  WS2812_5050  [WS2812-5X5-4PIN]
D231  WS2812_5050  [WS2812-5X5-4PIN]
D232  WS2812_5050  [WS2812-5X5-4PIN]
D233  WS2812_5050  [WS2812-5X5-4PIN]
D234  WS2812_5050  [WS2812-5X5-4PIN]
D235  WS2812_5050  [WS2812-5X5-4PIN]
D236  WS2812_5050  [WS2812-5X5-4PIN]
D237  WS2812_5050  [WS2812-5X5-4PIN]
D238  WS2812_5050  [WS2812-5X5-4PIN]
D239  WS2812_5050  [WS2812-5X5-4PIN]
D240  WS2812_5050  [WS2812-5X5-4PIN]

### Nets
DO121: D121.DO ; also sheet 4
DO122: D121.DI D122.DO
DO123: D122.DI D123.DO
DO124: D123.DI D124.DO
DO125: D124.DI D125.DO
DO126: D125.DI D126.DO
DO127: D126.DI D127.DO
DO128: D127.DI D128.DO
DO129: D128.DI D129.DO
DO130: D129.DI D130.DO
DO131: D130.DI D131.DO
DO132: D131.DI D132.DO
DO133: D132.DI D133.DO
DO134: D133.DI D134.DO
DO135: D134.DI D135.DO
DO136: D135.DI D136.DO
DO137: D136.DI D137.DO
DO138: D137.DI D138.DO
DO139: D138.DI D139.DO
DO140: D139.DI D140.DO
DO141: D140.DI D141.DO
DO142: D141.DI D142.DO
DO143: D142.DI D143.DO
DO144: D143.DI D144.DO
DO145: D144.DI D145.DO
DO146: D145.DI D146.DO
DO147: D146.DI D147.DO
DO148: D147.DI D148.DO
DO149: D148.DI D149.DO
DO150: D149.DI D150.DO
DO151: D150.DI D151.DO
DO152: D151.DI D152.DO
DO153: D152.DI D153.DO
DO154: D153.DI D154.DO
DO155: D154.DI D155.DO
DO156: D155.DI D156.DO
DO157: D156.DI D157.DO
DO158: D157.DI D158.DO
DO159: D158.DI D159.DO
DO160: D159.DI D160.DO
DO161: D160.DI D161.DO
DO162: D161.DI D162.DO
DO163: D162.DI D163.DO
DO164: D163.DI D164.DO
DO165: D164.DI D165.DO
DO166: D165.DI D166.DO
DO167: D166.DI D167.DO
DO168: D167.DI D168.DO
DO169: D168.DI D169.DO
DO170: D169.DI D170.DO
DO171: D170.DI D171.DO
DO172: D171.DI D172.DO
DO173: D172.DI D173.DO
DO174: D173.DI D174.DO
DO175: D174.DI D175.DO
DO176: D175.DI D176.DO
DO177: D176.DI D177.DO
DO178: D177.DI D178.DO
DO179: D178.DI D179.DO
DO180: D179.DI D180.DO
DO181: D180.DI D181.DO
DO182: D181.DI D182.DO
DO183: D182.DI D183.DO
DO184: D183.DI D184.DO
DO185: D184.DI D185.DO
DO186: D185.DI D186.DO
DO187: D186.DI D187.DO
DO188: D187.DI D188.DO
DO189: D188.DI D189.DO
DO190: D189.DI D190.DO
DO191: D190.DI D191.DO
DO192: D191.DI D192.DO
DO193: D192.DI D193.DO
DO194: D193.DI D194.DO
DO195: D194.DI D195.DO
DO196: D195.DI D196.DO
DO197: D196.DI D197.DO
DO198: D197.DI D198.DO
DO199: D198.DI D199.DO
DO200: D199.DI D200.DO
DO201: D200.DI D201.DO
DO202: D201.DI D202.DO
DO203: D202.DI D203.DO
DO204: D203.DI D204.DO
DO205: D204.DI D205.DO
DO206: D205.DI D206.DO
DO207: D206.DI D207.DO
DO208: D207.DI D208.DO
DO209: D208.DI D209.DO
DO210: D209.DI D210.DO
DO211: D210.DI D211.DO
DO212: D211.DI D212.DO
DO213: D212.DI D213.DO
DO214: D213.DI D214.DO
DO215: D214.DI D215.DO
DO216: D215.DI D216.DO
DO217: D216.DI D217.DO
DO218: D217.DI D218.DO
DO219: D218.DI D219.DO
DO220: D219.DI D220.DO
DO221: D220.DI D221.DO
DO222: D221.DI D222.DO
DO223: D222.DI D223.DO
DO224: D223.DI D224.DO
DO225: D224.DI D225.DO
DO226: D225.DI D226.DO
DO227: D226.DI D227.DO
DO228: D227.DI D228.DO
DO229: D228.DI D229.DO
DO230: D229.DI D230.DO
DO231: D230.DI D231.DO
DO232: D231.DI D232.DO
DO233: D232.DI D233.DO
DO234: D233.DI D234.DO
DO235: D234.DI D235.DO
DO236: D235.DI D236.DO
DO237: D236.DI D237.DO
DO238: D237.DI D238.DO
DO239: D238.DI D239.DO
DO240: D239.DI D240.DO
DO241: D240.DI ; also sheet 2
GND: D121.GND D122.GND D123.GND D124.GND D125.GND D126.GND D127.GND D128.GND D129.GND D130.GND D131.GND D132.GND D133.GND D134.GND D135.GND D136.GND D137.GND D138.GND D139.GND D140.GND D141.GND D142.GND D143.GND D144.GND D145.GND D146.GND D147.GND D148.GND D149.GND D150.GND D151.GND D152.GND D153.GND D154.GND D155.GND D156.GND D157.GND D158.GND D159.GND D160.GND D161.GND D162.GND D163.GND D164.GND D165.GND D166.GND D167.GND D168.GND D169.GND D170.GND D171.GND D172.GND D173.GND D174.GND D175.GND D176.GND D177.GND D178.GND D179.GND D180.GND D181.GND D182.GND D183.GND D184.GND D185.GND D186.GND D187.GND D188.GND D189.GND D190.GND D191.GND D192.GND D193.GND D194.GND D195.GND D196.GND D197.GND D198.GND D199.GND D200.GND D201.GND D202.GND D203.GND D204.GND D205.GND D206.GND D207.GND D208.GND D209.GND D210.GND D211.GND D212.GND D213.GND D214.GND D215.GND D216.GND D217.GND D218.GND D219.GND D220.GND D221.GND D222.GND D223.GND D224.GND D225.GND D226.GND D227.GND D228.GND D229.GND D230.GND D231.GND D232.GND D233.GND D234.GND D235.GND D236.GND D237.GND D238.GND D239.GND D240.GND ; also sheet 1,2,4
VCC: D121.VCC D122.VCC D123.VCC D124.VCC D125.VCC D126.VCC D127.VCC D128.VCC D129.VCC D130.VCC D131.VCC D132.VCC D133.VCC D134.VCC D135.VCC D136.VCC D137.VCC D138.VCC D139.VCC D140.VCC D141.VCC D142.VCC D143.VCC D144.VCC D145.VCC D146.VCC D147.VCC D148.VCC D149.VCC D150.VCC D151.VCC D152.VCC D153.VCC D154.VCC D155.VCC D156.VCC D157.VCC D158.VCC D159.VCC D160.VCC D161.VCC D162.VCC D163.VCC D164.VCC D165.VCC D166.VCC D167.VCC D168.VCC D169.VCC D170.VCC D171.VCC D172.VCC D173.VCC D174.VCC D175.VCC D176.VCC D177.VCC D178.VCC D179.VCC D180.VCC D181.VCC D182.VCC D183.VCC D184.VCC D185.VCC D186.VCC D187.VCC D188.VCC D189.VCC D190.VCC D191.VCC D192.VCC D193.VCC D194.VCC D195.VCC D196.VCC D197.VCC D198.VCC D199.VCC D200.VCC D201.VCC D202.VCC D203.VCC D204.VCC D205.VCC D206.VCC D207.VCC D208.VCC D209.VCC D210.VCC D211.VCC D212.VCC D213.VCC D214.VCC D215.VCC D216.VCC D217.VCC D218.VCC D219.VCC D220.VCC D221.VCC D222.VCC D223.VCC D224.VCC D225.VCC D226.VCC D227.VCC D228.VCC D229.VCC D230.VCC D231.VCC D232.VCC D233.VCC D234.VCC D235.VCC D236.VCC D237.VCC D238.VCC D239.VCC D240.VCC ; also sheet 1,2,4

### Notes on the sheet
- Ring 9 (56) | Ring 9 (56)
- Ring 9 (56) | Ring 8 (50)
- Ring 8 (50)
- Ring 8 (50)
- Ring 8 (50) | Ring 7 (42)
- Ring 7 (42) | Ring 7 (42)
- Ring 7 (42) | Ring 7 (42)
- Ring 7 (42) | Ring 6 (36)

## Sheet 4 of 4
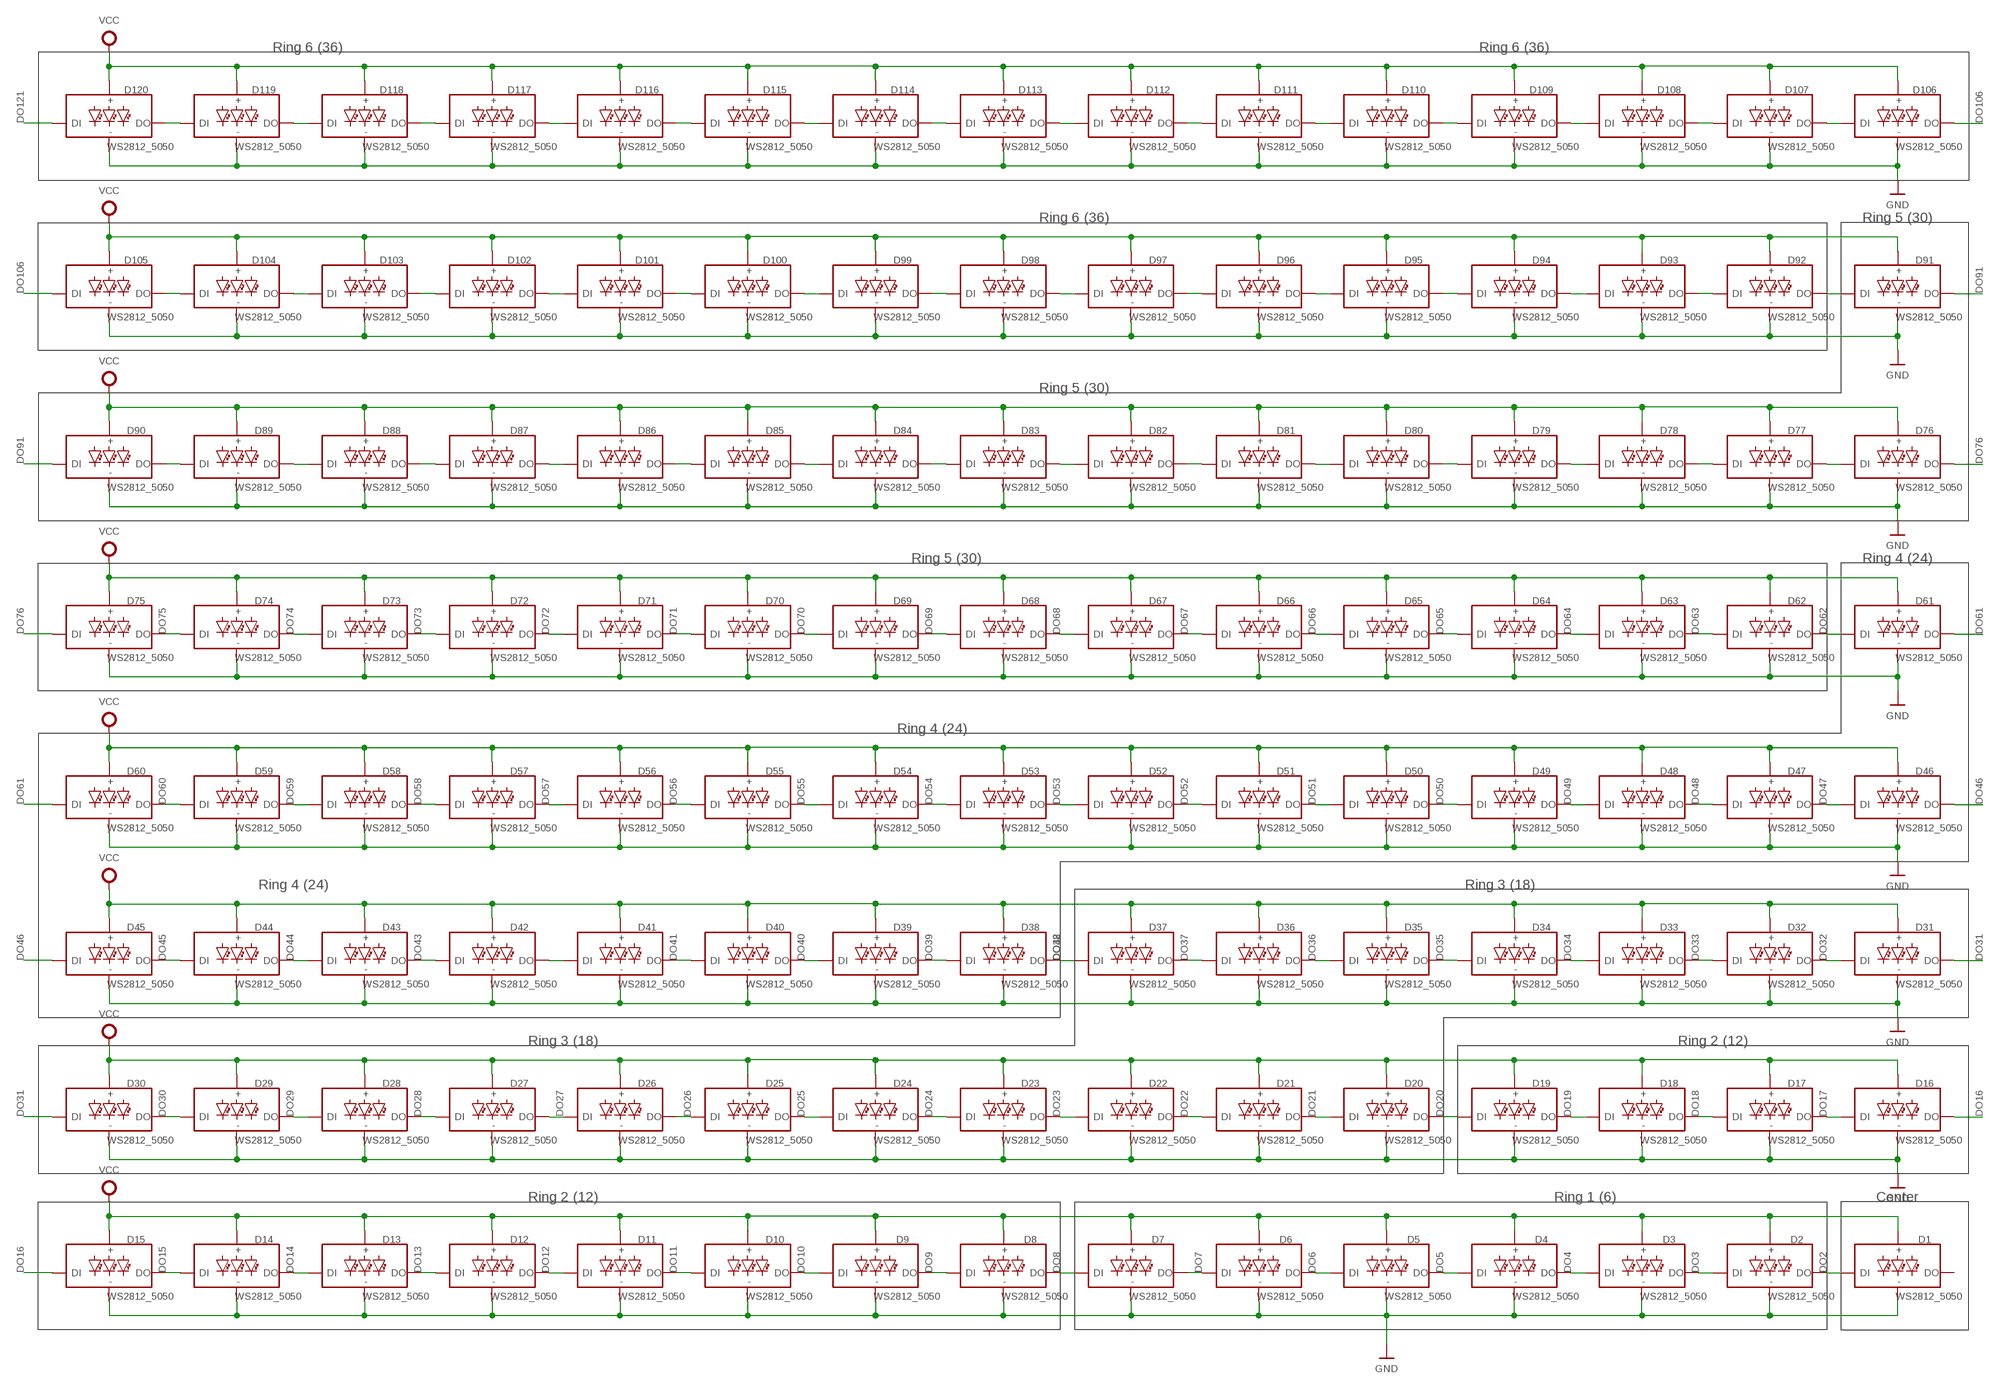
[diagram p3: schematic, sheet 4]

### Parts
D1  WS2812_5050  [WS2812-5X5-4PIN]
D2  WS2812_5050  [WS2812-5X5-4PIN]
D3  WS2812_5050  [WS2812-5X5-4PIN]
D4  WS2812_5050  [WS2812-5X5-4PIN]
D5  WS2812_5050  [WS2812-5X5-4PIN]
D6  WS2812_5050  [WS2812-5X5-4PIN]
D7  WS2812_5050  [WS2812-5X5-4PIN]
D8  WS2812_5050  [WS2812-5X5-4PIN]
D9  WS2812_5050  [WS2812-5X5-4PIN]
D10  WS2812_5050  [WS2812-5X5-4PIN]
D11  WS2812_5050  [WS2812-5X5-4PIN]
D12  WS2812_5050  [WS2812-5X5-4PIN]
D13  WS2812_5050  [WS2812-5X5-4PIN]
D14  WS2812_5050  [WS2812-5X5-4PIN]
D15  WS2812_5050  [WS2812-5X5-4PIN]
D16  WS2812_5050  [WS2812-5X5-4PIN]
D17  WS2812_5050  [WS2812-5X5-4PIN]
D18  WS2812_5050  [WS2812-5X5-4PIN]
D19  WS2812_5050  [WS2812-5X5-4PIN]
D20  WS2812_5050  [WS2812-5X5-4PIN]
D21  WS2812_5050  [WS2812-5X5-4PIN]
D22  WS2812_5050  [WS2812-5X5-4PIN]
D23  WS2812_5050  [WS2812-5X5-4PIN]
D24  WS2812_5050  [WS2812-5X5-4PIN]
D25  WS2812_5050  [WS2812-5X5-4PIN]
D26  WS2812_5050  [WS2812-5X5-4PIN]
D27  WS2812_5050  [WS2812-5X5-4PIN]
D28  WS2812_5050  [WS2812-5X5-4PIN]
D29  WS2812_5050  [WS2812-5X5-4PIN]
D30  WS2812_5050  [WS2812-5X5-4PIN]
D31  WS2812_5050  [WS2812-5X5-4PIN]
D32  WS2812_5050  [WS2812-5X5-4PIN]
D33  WS2812_5050  [WS2812-5X5-4PIN]
D34  WS2812_5050  [WS2812-5X5-4PIN]
D35  WS2812_5050  [WS2812-5X5-4PIN]
D36  WS2812_5050  [WS2812-5X5-4PIN]
D37  WS2812_5050  [WS2812-5X5-4PIN]
D38  WS2812_5050  [WS2812-5X5-4PIN]
D39  WS2812_5050  [WS2812-5X5-4PIN]
D40  WS2812_5050  [WS2812-5X5-4PIN]
D41  WS2812_5050  [WS2812-5X5-4PIN]
D42  WS2812_5050  [WS2812-5X5-4PIN]
D43  WS2812_5050  [WS2812-5X5-4PIN]
D44  WS2812_5050  [WS2812-5X5-4PIN]
D45  WS2812_5050  [WS2812-5X5-4PIN]
D46  WS2812_5050  [WS2812-5X5-4PIN]
D47  WS2812_5050  [WS2812-5X5-4PIN]
D48  WS2812_5050  [WS2812-5X5-4PIN]
D49  WS2812_5050  [WS2812-5X5-4PIN]
D50  WS2812_5050  [WS2812-5X5-4PIN]
D51  WS2812_5050  [WS2812-5X5-4PIN]
D52  WS2812_5050  [WS2812-5X5-4PIN]
D53  WS2812_5050  [WS2812-5X5-4PIN]
D54  WS2812_5050  [WS2812-5X5-4PIN]
D55  WS2812_5050  [WS2812-5X5-4PIN]
D56  WS2812_5050  [WS2812-5X5-4PIN]
D57  WS2812_5050  [WS2812-5X5-4PIN]
D58  WS2812_5050  [WS2812-5X5-4PIN]
D59  WS2812_5050  [WS2812-5X5-4PIN]
D60  WS2812_5050  [WS2812-5X5-4PIN]
D61  WS2812_5050  [WS2812-5X5-4PIN]
D62  WS2812_5050  [WS2812-5X5-4PIN]
D63  WS2812_5050  [WS2812-5X5-4PIN]
D64  WS2812_5050  [WS2812-5X5-4PIN]
D65  WS2812_5050  [WS2812-5X5-4PIN]
D66  WS2812_5050  [WS2812-5X5-4PIN]
D67  WS2812_5050  [WS2812-5X5-4PIN]
D68  WS2812_5050  [WS2812-5X5-4PIN]
D69  WS2812_5050  [WS2812-5X5-4PIN]
D70  WS2812_5050  [WS2812-5X5-4PIN]
D71  WS2812_5050  [WS2812-5X5-4PIN]
D72  WS2812_5050  [WS2812-5X5-4PIN]
D73  WS2812_5050  [WS2812-5X5-4PIN]
D74  WS2812_5050  [WS2812-5X5-4PIN]
D75  WS2812_5050  [WS2812-5X5-4PIN]
D76  WS2812_5050  [WS2812-5X5-4PIN]
D77  WS2812_5050  [WS2812-5X5-4PIN]
D78  WS2812_5050  [WS2812-5X5-4PIN]
D79  WS2812_5050  [WS2812-5X5-4PIN]
D80  WS2812_5050  [WS2812-5X5-4PIN]
D81  WS2812_5050  [WS2812-5X5-4PIN]
D82  WS2812_5050  [WS2812-5X5-4PIN]
D83  WS2812_5050  [WS2812-5X5-4PIN]
D84  WS2812_5050  [WS2812-5X5-4PIN]
D85  WS2812_5050  [WS2812-5X5-4PIN]
D86  WS2812_5050  [WS2812-5X5-4PIN]
D87  WS2812_5050  [WS2812-5X5-4PIN]
D88  WS2812_5050  [WS2812-5X5-4PIN]
D89  WS2812_5050  [WS2812-5X5-4PIN]
D90  WS2812_5050  [WS2812-5X5-4PIN]
D91  WS2812_5050  [WS2812-5X5-4PIN]
D92  WS2812_5050  [WS2812-5X5-4PIN]
D93  WS2812_5050  [WS2812-5X5-4PIN]
D94  WS2812_5050  [WS2812-5X5-4PIN]
D95  WS2812_5050  [WS2812-5X5-4PIN]
D96  WS2812_5050  [WS2812-5X5-4PIN]
D97  WS2812_5050  [WS2812-5X5-4PIN]
D98  WS2812_5050  [WS2812-5X5-4PIN]
D99  WS2812_5050  [WS2812-5X5-4PIN]
D100  WS2812_5050  [WS2812-5X5-4PIN]
D101  WS2812_5050  [WS2812-5X5-4PIN]
D102  WS2812_5050  [WS2812-5X5-4PIN]
D103  WS2812_5050  [WS2812-5X5-4PIN]
D104  WS2812_5050  [WS2812-5X5-4PIN]
D105  WS2812_5050  [WS2812-5X5-4PIN]
D106  WS2812_5050  [WS2812-5X5-4PIN]
D107  WS2812_5050  [WS2812-5X5-4PIN]
D108  WS2812_5050  [WS2812-5X5-4PIN]
D109  WS2812_5050  [WS2812-5X5-4PIN]
D110  WS2812_5050  [WS2812-5X5-4PIN]
D111  WS2812_5050  [WS2812-5X5-4PIN]
D112  WS2812_5050  [WS2812-5X5-4PIN]
D113  WS2812_5050  [WS2812-5X5-4PIN]
D114  WS2812_5050  [WS2812-5X5-4PIN]
D115  WS2812_5050  [WS2812-5X5-4PIN]
D116  WS2812_5050  [WS2812-5X5-4PIN]
D117  WS2812_5050  [WS2812-5X5-4PIN]
D118  WS2812_5050  [WS2812-5X5-4PIN]
D119  WS2812_5050  [WS2812-5X5-4PIN]
D120  WS2812_5050  [WS2812-5X5-4PIN]

### Nets
DO2: D1.DI D2.DO
DO3: D2.DI D3.DO
DO4: D3.DI D4.DO
DO5: D4.DI D5.DO
DO6: D5.DI D6.DO
DO7: D6.DI D7.DO
DO8: D7.DI D8.DO
DO9: D8.DI D9.DO
DO10: D9.DI D10.DO
DO11: D10.DI D11.DO
DO12: D11.DI D12.DO
DO13: D12.DI D13.DO
DO14: D13.DI D14.DO
DO15: D14.DI D15.DO
DO16: D15.DI D16.DO
DO17: D16.DI D17.DO
DO18: D17.DI D18.DO
DO19: D18.DI D19.DO
DO20: D19.DI D20.DO
DO21: D20.DI D21.DO
DO22: D21.DI D22.DO
DO23: D22.DI D23.DO
DO24: D23.DI D24.DO
DO25: D24.DI D25.DO
DO26: D25.DI D26.DO
DO27: D26.DI D27.DO
DO28: D27.DI D28.DO
DO29: D28.DI D29.DO
DO30: D29.DI D30.DO
DO31: D30.DI D31.DO
DO32: D31.DI D32.DO
DO33: D32.DI D33.DO
DO34: D33.DI D34.DO
DO35: D34.DI D35.DO
DO36: D35.DI D36.DO
DO37: D36.DI D37.DO
DO38: D37.DI D38.DO
DO39: D38.DI D39.DO
DO40: D39.DI D40.DO
DO41: D40.DI D41.DO
DO42: D41.DI D42.DO
DO43: D42.DI D43.DO
DO44: D43.DI D44.DO
DO45: D44.DI D45.DO
DO46: D45.DI D46.DO
DO47: D46.DI D47.DO
DO48: D47.DI D48.DO
DO49: D48.DI D49.DO
DO50: D49.DI D50.DO
DO51: D50.DI D51.DO
DO52: D51.DI D52.DO
DO53: D52.DI D53.DO
DO54: D53.DI D54.DO
DO55: D54.DI D55.DO
DO56: D55.DI D56.DO
DO57: D56.DI D57.DO
DO58: D57.DI D58.DO
DO59: D58.DI D59.DO
DO60: D59.DI D60.DO
DO61: D60.DI D61.DO
DO62: D61.DI D62.DO
DO63: D62.DI D63.DO
DO64: D63.DI D64.DO
DO65: D64.DI D65.DO
DO66: D65.DI D66.DO
DO67: D66.DI D67.DO
DO68: D67.DI D68.DO
DO69: D68.DI D69.DO
DO70: D69.DI D70.DO
DO71: D70.DI D71.DO
DO72: D71.DI D72.DO
DO73: D72.DI D73.DO
DO74: D73.DI D74.DO
DO75: D74.DI D75.DO
DO76: D75.DI D76.DO
DO77: D76.DI D77.DO
DO78: D77.DI D78.DO
DO79: D78.DI D79.DO
DO80: D79.DI D80.DO
DO81: D80.DI D81.DO
DO82: D81.DI D82.DO
DO83: D82.DI D83.DO
DO84: D83.DI D84.DO
DO85: D84.DI D85.DO
DO86: D85.DI D86.DO
DO87: D86.DI D87.DO
DO88: D87.DI D88.DO
DO89: D88.DI D89.DO
DO90: D89.DI D90.DO
DO91: D90.DI D91.DO
DO92: D91.DI D92.DO
DO93: D92.DI D93.DO
DO94: D93.DI D94.DO
DO95: D94.DI D95.DO
DO96: D95.DI D96.DO
DO97: D96.DI D97.DO
DO98: D97.DI D98.DO
DO99: D98.DI D99.DO
DO100: D99.DI D100.DO
DO101: D100.DI D101.DO
DO102: D101.DI D102.DO
DO103: D102.DI D103.DO
DO104: D103.DI D104.DO
DO105: D104.DI D105.DO
DO106: D105.DI D106.DO
DO107: D106.DI D107.DO
DO108: D107.DI D108.DO
DO109: D108.DI D109.DO
DO110: D109.DI D110.DO
DO111: D110.DI D111.DO
DO112: D111.DI D112.DO
DO113: D112.DI D113.DO
DO114: D113.DI D114.DO
DO115: D114.DI D115.DO
DO116: D115.DI D116.DO
DO117: D116.DI D117.DO
DO118: D117.DI D118.DO
DO119: D118.DI D119.DO
DO120: D119.DI D120.DO
DO121: D120.DI ; also sheet 3
GND: D1.GND D2.GND D3.GND D4.GND D5.GND D6.GND D7.GND D8.GND D9.GND D10.GND D11.GND D12.GND D13.GND D14.GND D15.GND D16.GND D17.GND D18.GND D19.GND D20.GND D21.GND D22.GND D23.GND D24.GND D25.GND D26.GND D27.GND D28.GND D29.GND D30.GND D31.GND D32.GND D33.GND D34.GND D35.GND D36.GND D37.GND D38.GND D39.GND D40.GND D41.GND D42.GND D43.GND D44.GND D45.GND D46.GND D47.GND D48.GND D49.GND D50.GND D51.GND D52.GND D53.GND D54.GND D55.GND D56.GND D57.GND D58.GND D59.GND D60.GND D61.GND D62.GND D63.GND D64.GND D65.GND D66.GND D67.GND D68.GND D69.GND D70.GND D71.GND D72.GND D73.GND D74.GND D75.GND D76.GND D77.GND D78.GND D79.GND D80.GND D81.GND D82.GND D83.GND D84.GND D85.GND D86.GND D87.GND D88.GND D89.GND D90.GND D91.GND D92.GND D93.GND D94.GND D95.GND D96.GND D97.GND D98.GND D99.GND D100.GND D101.GND D102.GND D103.GND D104.GND D105.GND D106.GND D107.GND D108.GND D109.GND D110.GND D111.GND D112.GND D113.GND D114.GND D115.GND D116.GND D117.GND D118.GND D119.GND D120.GND ; also sheet 1,2,3
VCC: D1.VCC D2.VCC D3.VCC D4.VCC D5.VCC D6.VCC D7.VCC D8.VCC D9.VCC D10.VCC D11.VCC D12.VCC D13.VCC D14.VCC D15.VCC D16.VCC D17.VCC D18.VCC D19.VCC D20.VCC D21.VCC D22.VCC D23.VCC D24.VCC D25.VCC D26.VCC D27.VCC D28.VCC D29.VCC D30.VCC D31.VCC D32.VCC D33.VCC D34.VCC D35.VCC D36.VCC D37.VCC D38.VCC D39.VCC D40.VCC D41.VCC D42.VCC D43.VCC D44.VCC D45.VCC D46.VCC D47.VCC D48.VCC D49.VCC D50.VCC D51.VCC D52.VCC D53.VCC D54.VCC D55.VCC D56.VCC D57.VCC D58.VCC D59.VCC D60.VCC D61.VCC D62.VCC D63.VCC D64.VCC D65.VCC D66.VCC D67.VCC D68.VCC D69.VCC D70.VCC D71.VCC D72.VCC D73.VCC D74.VCC D75.VCC D76.VCC D77.VCC D78.VCC D79.VCC D80.VCC D81.VCC D82.VCC D83.VCC D84.VCC D85.VCC D86.VCC D87.VCC D88.VCC D89.VCC D90.VCC D91.VCC D92.VCC D93.VCC D94.VCC D95.VCC D96.VCC D97.VCC D98.VCC D99.VCC D100.VCC D101.VCC D102.VCC D103.VCC D104.VCC D105.VCC D106.VCC D107.VCC D108.VCC D109.VCC D110.VCC D111.VCC D112.VCC D113.VCC D114.VCC D115.VCC D116.VCC D117.VCC D118.VCC D119.VCC D120.VCC ; also sheet 1,2,3
Unconnected: D1.DO

### Notes on the sheet
- Ring 6 (36) | Ring 6 (36)
- Ring 6 (36) | Ring 5 (30)
- Ring 5 (30)
- Ring 5 (30) | Ring 4 (24)
- Ring 4 (24)
- Ring 4 (24) | Ring 3 (18)
- Ring 3 (18) | Ring 2 (12)
- Ring 2 (12) | Ring 1 (6) | Center

## Library data of the parts
C1-C24 = rcl-rs:CPOL-EU: POLARIZED CAPACITOR, European symbol timestamp: 1724679339
C25-C169 = rcl-rs:C-EU: CAPACITOR, European symbol timestamp: 1724679339
D1-D405 = led-rs:WS2812: Addressable RGB LED - 1 Wire Common names: WS2812, SK6812, Neopixel, APA-106, etc. SMD LED with built-in controller IC. Color: Red/Green/Blue SparkFun Products: LED-SMD RGB (WS2812) <https://www.sparkfun.com/products/11821> LED - RGB Addressable, PTH, 5mm Diffused (5 Pack) <https://www.sparkfun.com/products/12986> LED - RGB Addressable, PTH, 5mm Clear (5 Pack) <https://www.sparkfun.com/products/12999> Blynk Board - ESP8266 <https://www.sparkfun.com/products/13794> Datasheet referenced for footprint: WS2812B-PTH <https://cdn.sparkfun.com/datasheets/Components/LED/COM-12877.pdf> timestamp: 1723100194
JP1 JP2 = con-molex-c-grid:70543-07: C-Grid SL timestamp: 1599246566
R1 = rcl-rs:R-EU: RESISTOR, European symbol timestamp: 1724679339
U2 U4 = adafruit-rs:FIDUCIAL: For use by pick and place machines to calibrate the vision/machine, 1mm By microbuilder.eu timestamp: 1733736029
Z1 = suppressors-littelfuse-smaj_CA_A:SMAJ*CA: SMAJxxCA Series of bidirectional Transient Voltage Suppressor Diodes xx = Stand-off Voltage VR in Volts; PPM = 400 W (300 W) @ 10/1000 us; IFSM = 40 A Case: SMA (JEDEC DO214AC) Author: Dipl.-Ing. FH Rainer Bayer, www.ing-rb.de/hhn Feedback: rainer.bayer@hs-heilbronn.de timestamp: 1601901028